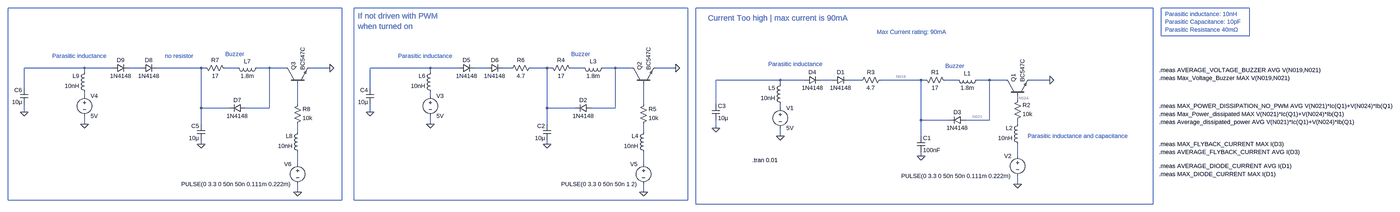
[diagram p0: schematic Buzzer simulation.asc, whole sheet]
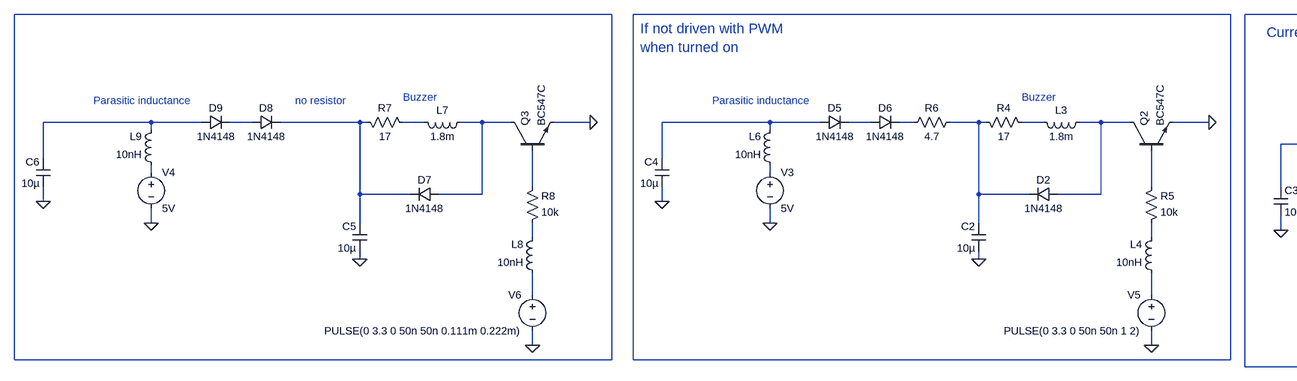
[diagram p1: schematic Buzzer simulation.asc, part, row 1 of 1, column 1 of 2]
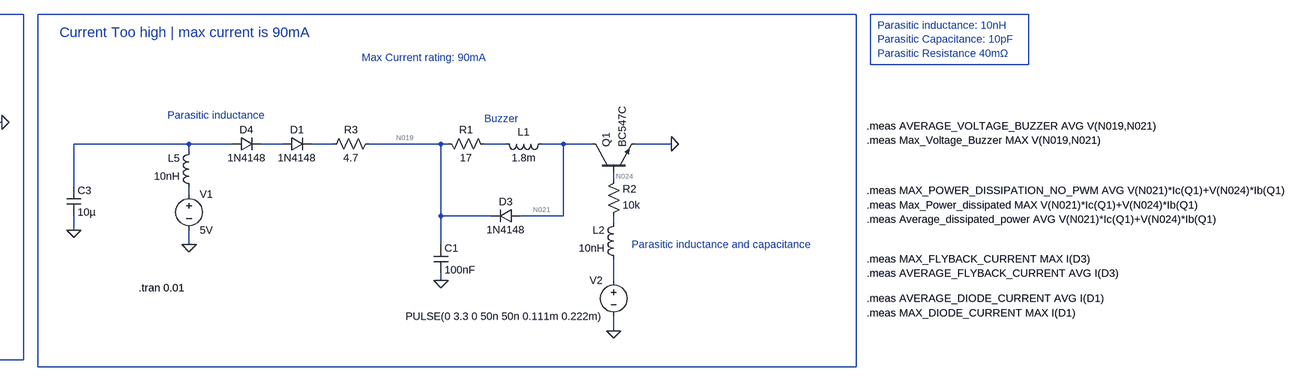
[diagram p2: schematic Buzzer simulation.asc, part, row 1 of 1, column 2 of 2]
Buzzer simulation.asc, the LTspice schematic file:
Version 4.1
SHEET 1 3628 680
WIRE -1552 -464 -2880 -464
WIRE -176 -464 -1504 -464
WIRE 1968 -464 -144 -464
WIRE 2352 -464 2000 -464
WIRE 2000 -352 2000 -464
WIRE 2352 -352 2352 -464
WIRE 2352 -352 2000 -352
WIRE -2576 -224 -2816 -224
WIRE -2464 -224 -2576 -224
WIRE -2352 -224 -2400 -224
WIRE -2112 -224 -2288 -224
WIRE -2096 -224 -2112 -224
WIRE -1968 -224 -2016 -224
WIRE -1840 -224 -1888 -224
WIRE -1776 -224 -1840 -224
WIRE -1600 -224 -1680 -224
WIRE -1200 -224 -1440 -224
WIRE -1088 -224 -1200 -224
WIRE -976 -224 -1024 -224
WIRE -880 -224 -912 -224
WIRE -736 -224 -800 -224
WIRE -720 -224 -736 -224
WIRE -592 -224 -640 -224
WIRE -464 -224 -512 -224
WIRE -400 -224 -464 -224
WIRE -224 -224 -304 -224
WIRE -2576 -208 -2576 -224
WIRE -1200 -208 -1200 -224
WIRE 192 -176 -64 -176
WIRE 288 -176 192 -176
WIRE 400 -176 352 -176
WIRE 512 -176 464 -176
WIRE 752 -176 592 -176
WIRE 768 -176 752 -176
WIRE 896 -176 848 -176
WIRE 1024 -176 976 -176
WIRE 1088 -176 1024 -176
WIRE 1264 -176 1184 -176
WIRE 192 -160 192 -176
WIRE -2816 -144 -2816 -224
WIRE -1440 -144 -1440 -224
WIRE -2576 -112 -2576 -128
WIRE -1200 -112 -1200 -128
WIRE 1136 -96 1136 -112
WIRE -1728 -80 -1728 -160
WIRE -352 -80 -352 -160
WIRE -64 -80 -64 -176
WIRE -2112 -64 -2112 -224
WIRE -2000 -64 -2112 -64
WIRE -1840 -64 -1840 -224
WIRE -1840 -64 -1936 -64
WIRE -736 -64 -736 -224
WIRE -624 -64 -736 -64
WIRE -464 -64 -464 -224
WIRE -464 -64 -560 -64
WIRE 192 -64 192 -80
WIRE -2816 -48 -2816 -80
WIRE -1440 -48 -1440 -80
WIRE 752 -16 752 -176
WIRE 864 -16 752 -16
WIRE 1024 -16 1024 -176
WIRE 1024 -16 928 -16
WIRE -2576 0 -2576 -32
WIRE -2112 0 -2112 -64
WIRE -1200 0 -1200 -32
WIRE -736 0 -736 -64
WIRE 1136 0 1136 -16
WIRE -64 16 -64 -16
WIRE -1728 32 -1728 0
WIRE -352 32 -352 0
WIRE 192 48 192 16
WIRE 752 48 752 -16
WIRE -2112 80 -2112 64
WIRE -736 80 -736 64
WIRE 752 128 752 112
WIRE 1136 128 1136 80
WIRE -1728 160 -1728 112
WIRE -352 160 -352 112
WIRE 1136 240 1136 208
WIRE -1728 272 -1728 240
WIRE -352 272 -352 240
WIRE -2880 304 -2880 -464
WIRE -1552 304 -1552 -464
WIRE -1552 304 -2880 304
WIRE -1504 304 -1504 -464
WIRE -176 304 -176 -464
WIRE -176 304 -1504 304
WIRE -144 320 -144 -464
WIRE 1968 320 1968 -464
WIRE 1968 320 -144 320
FLAG 752 128 0
FLAG 1264 -176 0
FLAG 1136 240 0
FLAG 192 48 0
FLAG -64 16 0
FLAG -736 80 0
FLAG -224 -224 0
FLAG -352 272 0
FLAG -1200 0 0
FLAG -1440 -48 0
FLAG -2112 80 0
FLAG -1600 -224 0
FLAG -1728 272 0
FLAG -2576 0 0
FLAG -2816 -48 0
SYMBOL res 752 -192 M90
WINDOW 0 0 56 VBottom 2
WINDOW 3 32 56 VTop 2
SYMATTR InstName R1
SYMATTR Value 17
SYMATTR SpiceLine tol=17 pwr=26
SYMBOL ind 880 -192 M90
WINDOW 0 5 56 VBottom 2
WINDOW 3 32 56 VTop 2
SYMATTR InstName L1
SYMATTR Value 1.8m
SYMATTR SpiceLine Ipk=0.95 Rser=1.63 Rpar=139043 Cpar=0 mfg="Coilcraft" pn="MSS1210-185"
SYMBOL voltage 192 -80 R0
WINDOW 123 0 0 Left 0
WINDOW 39 0 0 Left 0
SYMATTR InstName V1
SYMATTR Value 5V
SYMBOL diode 928 0 M270
WINDOW 0 32 32 VTop 2
WINDOW 3 0 32 VBottom 2
SYMATTR InstName D3
SYMATTR Value 1N4148
SYMBOL cap 736 112 M180
WINDOW 0 24 56 Left 2
WINDOW 3 24 8 Left 2
SYMATTR InstName C1
SYMATTR Value 100nF
SYMATTR SpiceLine V=16 Irms=0 Rser=0 Lser=0
SYMBOL npn 1088 -112 R270
SYMATTR InstName Q1
SYMATTR Value BC547C
SYMBOL res 1120 0 M180
WINDOW 0 36 76 Left 2
WINDOW 3 36 40 Left 2
SYMATTR InstName R2
SYMATTR Value 10k
SYMBOL voltage 1136 112 M0
WINDOW 123 0 0 Left 0
WINDOW 39 0 0 Left 0
SYMATTR InstName V2
SYMATTR Value PULSE(0 3.3 0 50n 50n 0.111m 0.222m)
SYMBOL diode 288 -192 M90
WINDOW 0 0 32 VBottom 2
WINDOW 3 32 32 VTop 2
SYMATTR InstName D4
SYMATTR Value 1N4148
SYMBOL diode 400 -192 M90
WINDOW 0 0 32 VBottom 2
WINDOW 3 32 32 VTop 2
SYMATTR InstName D1
SYMATTR Value 1N4148
SYMBOL res 496 -160 R270
WINDOW 0 32 56 VTop 2
WINDOW 3 0 56 VBottom 2
SYMATTR InstName R3
SYMATTR Value 4.7
SYMATTR SpiceLine tol=1
SYMBOL ind 1152 96 R180
WINDOW 0 36 80 Left 2
WINDOW 3 36 40 Left 2
SYMATTR InstName L2
SYMATTR Value 10nH
SYMATTR SpiceLine Ipk=1 Rser=40m Cpar=10pF
SYMBOL cap -80 -16 M180
WINDOW 0 24 56 Left 2
WINDOW 3 24 8 Left 2
SYMATTR InstName C3
SYMATTR Value 10µ
SYMATTR SpiceLine V=16 Irms=0 Rser=0 Lser=0 mfg="Murata" pn="GRM21BZ71C106ME15" type="X7R"
SYMBOL res -736 -240 M90
WINDOW 0 0 56 VBottom 2
WINDOW 3 32 56 VTop 2
SYMATTR InstName R4
SYMATTR Value 17
SYMATTR SpiceLine tol=17 pwr=26
SYMBOL ind -608 -240 M90
WINDOW 0 5 56 VBottom 2
WINDOW 3 32 56 VTop 2
SYMATTR InstName L3
SYMATTR Value 1.8m
SYMATTR SpiceLine Ipk=0.95 Rser=1.63 Rpar=139043 Cpar=0 mfg="Coilcraft" pn="MSS1210-185"
SYMBOL voltage -1200 -128 R0
WINDOW 123 0 0 Left 0
WINDOW 39 0 0 Left 0
SYMATTR InstName V3
SYMATTR Value 5V
SYMBOL diode -560 -48 M270
WINDOW 0 32 32 VTop 2
WINDOW 3 0 32 VBottom 2
SYMATTR InstName D2
SYMATTR Value 1N4148
SYMBOL cap -720 0 M0
SYMATTR InstName C2
SYMATTR Value 10µ
SYMATTR SpiceLine V=16 Irms=0 Rser=0 Lser=0 mfg="Murata" pn="GRM21BZ71C106ME15" type="X7R"
SYMBOL npn -400 -160 R270
SYMATTR InstName Q2
SYMATTR Value BC547C
SYMBOL res -368 16 M180
WINDOW 0 36 76 Left 2
WINDOW 3 36 40 Left 2
SYMATTR InstName R5
SYMATTR Value 10k
SYMBOL diode -976 -240 M90
WINDOW 0 0 32 VBottom 2
WINDOW 3 32 32 VTop 2
SYMATTR InstName D6
SYMATTR Value 1N4148
SYMBOL res -896 -208 R270
WINDOW 0 32 56 VTop 2
WINDOW 3 0 56 VBottom 2
SYMATTR InstName R6
SYMATTR Value 4.7
SYMATTR SpiceLine tol=1
SYMBOL ind -336 128 R180
WINDOW 0 36 80 Left 2
WINDOW 3 36 40 Left 2
SYMATTR InstName L4
SYMATTR Value 10nH
SYMATTR SpiceLine Ipk=1 Rser=1m Cpar=10pF
SYMBOL cap -1424 -144 M0
SYMATTR InstName C4
SYMATTR Value 10µ
SYMATTR SpiceLine V=16 Irms=0 Rser=0 Lser=0 mfg="Murata" pn="GRM21BZ71C106ME15" type="X7R"
SYMBOL ind 208 -64 R180
WINDOW 0 36 80 Left 2
WINDOW 3 36 40 Left 2
SYMATTR InstName L5
SYMATTR Value 10nH
SYMATTR SpiceLine Ipk=1 Rser=40m Cpar=10pF
SYMBOL ind -1184 -112 R180
WINDOW 0 36 80 Left 2
WINDOW 3 36 40 Left 2
SYMATTR InstName L6
SYMATTR Value 10nH
SYMATTR SpiceLine Ipk=1 Rser=40m Cpar=10pF
SYMBOL diode -1088 -240 M90
WINDOW 0 0 32 VBottom 2
WINDOW 3 32 32 VTop 2
SYMATTR InstName D5
SYMATTR Value 1N4148
SYMBOL voltage -352 144 M0
WINDOW 123 0 0 Left 0
WINDOW 39 0 0 Left 0
SYMATTR InstName V5
SYMATTR Value PULSE(0 3.3 0 50n 50n 1 2)
SYMBOL res -2112 -240 M90
WINDOW 0 0 56 VBottom 2
WINDOW 3 32 56 VTop 2
SYMATTR InstName R7
SYMATTR Value 17
SYMATTR SpiceLine tol=17 pwr=26
SYMBOL ind -1984 -240 M90
WINDOW 0 5 56 VBottom 2
WINDOW 3 32 56 VTop 2
SYMATTR InstName L7
SYMATTR Value 1.8m
SYMATTR SpiceLine Ipk=0.95 Rser=1.63 Rpar=139043 Cpar=0 mfg="Coilcraft" pn="MSS1210-185"
SYMBOL voltage -2576 -128 R0
WINDOW 123 0 0 Left 0
WINDOW 39 0 0 Left 0
SYMATTR InstName V4
SYMATTR Value 5V
SYMBOL diode -1936 -48 M270
WINDOW 0 32 32 VTop 2
WINDOW 3 0 32 VBottom 2
SYMATTR InstName D7
SYMATTR Value 1N4148
SYMBOL cap -2096 0 M0
SYMATTR InstName C5
SYMATTR Value 10µ
SYMATTR SpiceLine V=16 Irms=0 Rser=0 Lser=0 mfg="Murata" pn="GRM21BZ71C106ME15" type="X7R"
SYMBOL npn -1776 -160 R270
SYMATTR InstName Q3
SYMATTR Value BC547C
SYMBOL res -1744 16 M180
WINDOW 0 36 76 Left 2
WINDOW 3 36 40 Left 2
SYMATTR InstName R8
SYMATTR Value 10k
SYMBOL diode -2352 -240 M90
WINDOW 0 0 32 VBottom 2
WINDOW 3 32 32 VTop 2
SYMATTR InstName D8
SYMATTR Value 1N4148
SYMBOL ind -1712 128 R180
WINDOW 0 36 80 Left 2
WINDOW 3 36 40 Left 2
SYMATTR InstName L8
SYMATTR Value 10nH
SYMATTR SpiceLine Ipk=1 Rser=1m Cpar=10pF
SYMBOL cap -2800 -144 M0
SYMATTR InstName C6
SYMATTR Value 10µ
SYMATTR SpiceLine V=16 Irms=0 Rser=0 Lser=0 mfg="Murata" pn="GRM21BZ71C106ME15" type="X7R"
SYMBOL ind -2560 -112 R180
WINDOW 0 36 80 Left 2
WINDOW 3 36 40 Left 2
SYMATTR InstName L9
SYMATTR Value 10nH
SYMATTR SpiceLine Ipk=1 Rser=40m Cpar=10pF
SYMBOL diode -2464 -240 M90
WINDOW 0 0 32 VBottom 2
WINDOW 3 32 32 VTop 2
SYMATTR InstName D9
SYMATTR Value 1N4148
SYMBOL voltage -1728 144 M0
WINDOW 123 0 0 Left 0
WINDOW 39 0 0 Left 0
SYMATTR InstName V6
SYMATTR Value PULSE(0 3.3 0 50n 50n 0.111m 0.222m)
TEXT 576 -368 Left 2 ;Max Current rating: 90mA
TEXT 848 -232 Left 2 ;Buzzer
TEXT 80 144 Left 2 !.tran 0.01
TEXT 1176 48 Left 2 ;Parasitic inductance and capacitance
TEXT -640 -280 Left 2 ;Buzzer
TEXT -1488 -432 Left 3 ;If not driven with PWM\nwhen turned on
TEXT -96 -424 Left 3 ;Current Too high | max current is 90mA
TEXT -1328 -272 Left 2 ;Parasitic inductance
TEXT 144 -240 Left 2 ;Parasitic inductance
TEXT -2016 -280 Left 2 ;Buzzer
TEXT -2704 -272 Left 2 ;Parasitic inductance
TEXT -2256 -272 Left 2 ;no resistor
TEXT 1992 -184 Left 2 !.meas Max_Voltage_Buzzer MAX V(N019,N021)
TEXT 1992 -40 Left 2 !.meas Max_Power_dissipated MAX V(N021)*Ic(Q1)+V(N024)*Ib(Q1)
TEXT 1992 -8 Left 2 !.meas Average_dissipated_power AVG V(N021)*Ic(Q1)+V(N024)*Ib(Q1)
TEXT 2016 -440 Left 2 ;Parasitic inductance: 10nH\nParasitic Capacitance: 10pF\nParasitic Resistance 40mΩ
TEXT 1992 -72 Left 2 !.meas MAX_POWER_DISSIPATION_NO_PWM AVG V(N021)*Ic(Q1)+V(N024)*Ib(Q1)
TEXT 1992 -216 Left 2 !.meas AVERAGE_VOLTAGE_BUZZER AVG V(N019,N021)
TEXT 1992 80 Left 2 !.meas MAX_FLYBACK_CURRENT MAX I(D3)
TEXT 1992 112 Left 2 !.meas AVERAGE_FLYBACK_CURRENT AVG I(D3)
TEXT 1992 168 Left 2 !.meas AVERAGE_DIODE_CURRENT AVG I(D1)
TEXT 1992 200 Left 2 !.meas MAX_DIODE_CURRENT MAX I(D1)

The netlist it stands for:
* Buzzer simulation.asc
R1 N019 N020 17 tol=17 pwr=26
L1 N020 N021 1.8m Ipk=0.95 Rser=1.63 Rpar=139043 Cpar=0 mfg="Coilcraft" pn="MSS1210-185"
V1 N027 0 5V
D3 N021 N019 1N4148
C1 0 N019 100nF V=16 Irms=0 Rser=0 Lser=0
Q1 N021 N024 0 0 BC547C
R2 N028 N024 10k
V2 N031 0 PULSE(0 3.3 0 50n 50n 0.111m 0.222m)
D4 N016 N017 1N4148
D1 N017 N018 1N4148
R3 N018 N019 4.7 tol=1
L2 N031 N028 10nH Ipk=1 Rser=40m Cpar=10pF
C3 0 N016 10µ V=16 Irms=0 Rser=0 Lser=0 mfg="Murata" pn="GRM21BZ71C106ME15" type="X7R"
R4 N013 N014 17 tol=17 pwr=26
L3 N014 N015 1.8m Ipk=0.95 Rser=1.63 Rpar=139043 Cpar=0 mfg="Coilcraft" pn="MSS1210-185"
V3 N023 0 5V
D2 N015 N013 1N4148
C2 N013 0 10µ V=16 Irms=0 Rser=0 Lser=0 mfg="Murata" pn="GRM21BZ71C106ME15" type="X7R"
Q2 N015 N026 0 0 BC547C
R5 N030 N026 10k
D6 N011 N012 1N4148
R6 N012 N013 4.7 tol=1
L4 N033 N030 10nH Ipk=1 Rser=1m Cpar=10pF
C4 N010 0 10µ V=16 Irms=0 Rser=0 Lser=0 mfg="Murata" pn="GRM21BZ71C106ME15" type="X7R"
L5 N027 N016 10nH Ipk=1 Rser=40m Cpar=10pF
L6 N023 N010 10nH Ipk=1 Rser=40m Cpar=10pF
D5 N010 N011 1N4148
V5 N033 0 PULSE(0 3.3 0 50n 50n 1 2)
R7 N007 N008 17 tol=17 pwr=26
L7 N008 N009 1.8m Ipk=0.95 Rser=1.63 Rpar=139043 Cpar=0 mfg="Coilcraft" pn="MSS1210-185"
V4 N022 0 5V
D7 N009 N007 1N4148
C5 N007 0 10µ V=16 Irms=0 Rser=0 Lser=0 mfg="Murata" pn="GRM21BZ71C106ME15" type="X7R"
Q3 N009 N025 0 0 BC547C
R8 N029 N025 10k
D8 N006 N007 1N4148
L8 N032 N029 10nH Ipk=1 Rser=1m Cpar=10pF
C6 N005 0 10µ V=16 Irms=0 Rser=0 Lser=0 mfg="Murata" pn="GRM21BZ71C106ME15" type="X7R"
L9 N022 N005 10nH Ipk=1 Rser=40m Cpar=10pF
D9 N005 N006 1N4148
V6 N032 0 PULSE(0 3.3 0 50n 50n 0.111m 0.222m)
.model D D
.lib standard.dio
.model NPN NPN
.model PNP PNP
.lib standard.bjt
* Max Current rating: 90mA
* Buzzer
.tran 0.01
* Parasitic inductance and capacitance
* Buzzer
* If not driven with PWM
* when turned on
* Current Too high | max current is 90mA
* Parasitic inductance
* Parasitic inductance
* Buzzer
* Parasitic inductance
* no resistor
.meas Max_Voltage_Buzzer MAX V(N019,N021)
.meas Max_Power_dissipated MAX V(N021)*Ic(Q1)+V(N024)*Ib(Q1)
.meas Average_dissipated_power AVG V(N021)*Ic(Q1)+V(N024)*Ib(Q1)
* Parasitic inductance: 10nH
* Parasitic Capacitance: 10pF
* Parasitic Resistance 40mΩ
.meas MAX_POWER_DISSIPATION_NO_PWM AVG V(N021)*Ic(Q1)+V(N024)*Ib(Q1)
.meas AVERAGE_VOLTAGE_BUZZER AVG V(N019,N021)
.meas MAX_FLYBACK_CURRENT MAX I(D3)
.meas AVERAGE_FLYBACK_CURRENT AVG I(D3)
.meas AVERAGE_DIODE_CURRENT AVG I(D1)
.meas MAX_DIODE_CURRENT MAX I(D1)
.backanno
.end